# Altium project EEG.PrjPcb
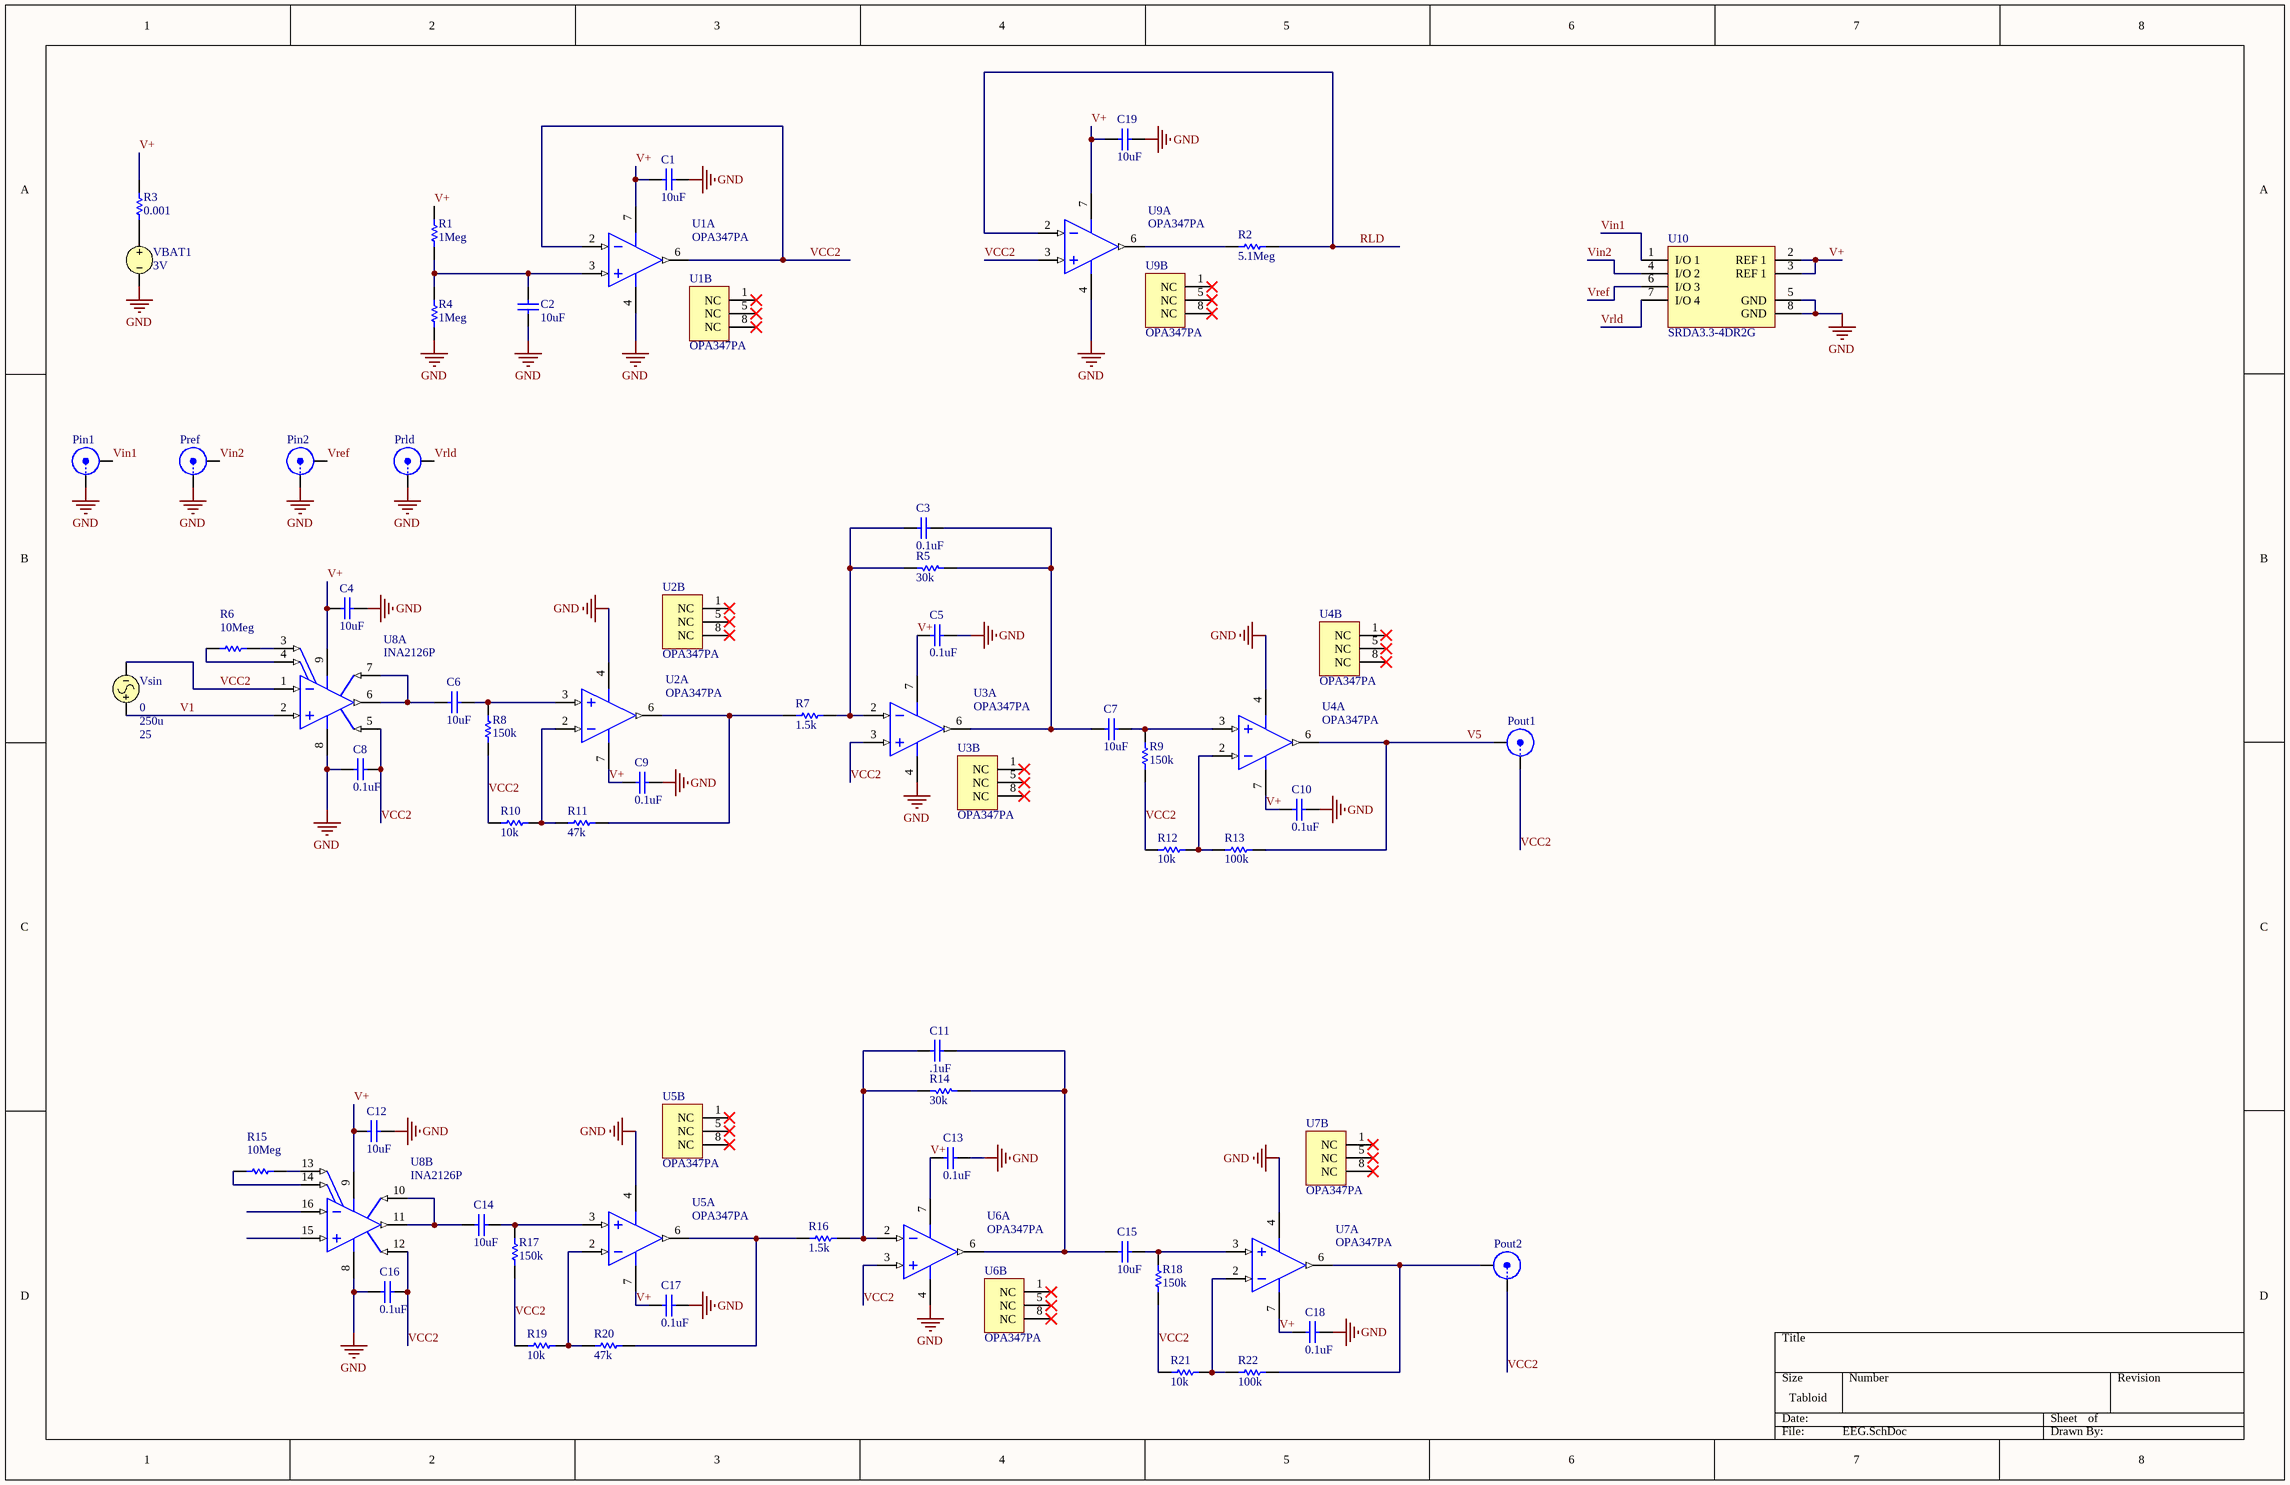
[diagram p0: EEG.SchDoc]
1 sheet, 59 parts. Net scope: global (net labels, ports and power ports of the same name join across sheets).

## Sheet EEG.SchDoc
size Tabloid; PageSetup: Record=PageOptions|CenterHorizontal=True|CenterVertical=True|PrintScale=1.00|XCorrection=1.00|YCorrection=1.00|PrintKind=1|BorderSize=5000000|LeftOffset=0|BottomOffset=0|Orientation=2|PaperLength=1000|PaperWidth=1000|Scale=100|PaperSource=7|PrintQuality=-3|MediaType=1|DitherType=10|PrintScaleMode=1|PaperKind=Statement|PaperIndex=6

### Parts
C1  10uF  [RAD-0.2]
C2  10uF  [RAD-0.2]
C3  0.1uF  [RAD-0.2]
C4  10uF  [RAD-0.2]
C5  0.1uF  [RAD-0.2]
C6  10uF  [RAD-0.2]
C7  10uF  [RAD-0.2]
C8  0.1uF  [RAD-0.2]
C9  0.1uF  [RAD-0.2]
C10  0.1uF  [RAD-0.2]
C11  .1uF  [RAD-0.2]
C12  10uF  [RAD-0.2]
C13  0.1uF  [RAD-0.2]
C14  10uF  [RAD-0.2]
C15  10uF  [RAD-0.2]
C16  0.1uF  [RAD-0.2]
C17  0.1uF  [RAD-0.2]
C18  0.1uF  [RAD-0.2]
C19  10uF  [RAD-0.2]
Pin1  BNC  [BNC_RA CON]  (value not drawn)
Pin2  BNC  [BNC_RA CON]  (value not drawn)
Pout1  BNC  [BNC_RA CON]  (value not drawn)
Pout2  BNC  [BNC_RA CON]  (value not drawn)
Pref  BNC  [BNC_RA CON]  (value not drawn)
Prld  BNC  [BNC_RA CON]  (value not drawn)
R1  1Meg  [AXIAL-0.3]
R2  5.1Meg  [AXIAL-0.3]
R3  0.001  [AXIAL-0.3]
R4  1Meg  [AXIAL-0.3]
R5  30k  [AXIAL-0.3]
R6  10Meg  [AXIAL-0.3]
R7  1.5k  [AXIAL-0.3]
R8  150k  [AXIAL-0.3]
R9  150k  [AXIAL-0.3]
R10  10k  [AXIAL-0.3]
R11  47k  [AXIAL-0.3]
R12  10k  [AXIAL-0.3]
R13  100k  [AXIAL-0.3]
R14  30k  [AXIAL-0.3]
R15  10Meg  [AXIAL-0.3]
R16  1.5k  [AXIAL-0.3]
R17  150k  [AXIAL-0.3]
R18  150k  [AXIAL-0.3]
R19  10k  [AXIAL-0.3]
R20  47k  [AXIAL-0.3]
R21  10k  [AXIAL-0.3]
R22  100k  [AXIAL-0.3]
U1  OPA347PA  [TI-P8]  (parts A,B of 2)
U2  OPA347PA  [TI-P8]  (parts A,B of 2)
U3  OPA347PA  [TI-P8]  (parts A,B of 2)
U4  OPA347PA  [TI-P8]  (parts A,B of 2)
U5  OPA347PA  [TI-P8]  (parts A,B of 2)
U6  OPA347PA  [TI-P8]  (parts A,B of 2)
U7  OPA347PA  [TI-P8]  (parts A,B of 2)
U8  INA2126P  [TI-N16]  (parts A,B of 2)
U9  OPA347PA  [TI-P8]  (parts A,B of 2)
U10  SRDA3.3-4DR2G  [ONSC-SOIC-8-751-07_V]
VBAT1  3V
Vsin  DC Magnitude: 0  Amplitude: 250u  Frequency: 25  (hidden comment: VSIN)

### Nets
GND: C1.1 C2.1 C4.1 C5.1 C8.2 C9.1 C10.1 C12.1 C13.1 C16.2 C17.1 C18.1 C19.1 Pin1.1(X) Pin2.1(X) Pref.1(X) Prld.1(X) R4.1 U1.4(V-) U2.4(V-) U3.4(V-) U4.4(V-) U5.4(V-) U6.4(V-) U7.4(V-) U8.8(V-) U9.4(V-) U10.5(GND) U10.8(GND) VBAT1.2
RLD: R2.1 U9.2(IN-)
V1: U8.2(VINA+) Vsin.1
V5: Pout1.2(Y) R13.2 U4.6(OUT)
V+: C1.2 C4.2 C5.2 C9.2 C10.2 C12.2 C13.2 C17.2 C18.2 C19.2 R1.2 R3.2 U1.7(V+) U2.7(V+) U3.7(V+) U4.7(V+) U5.7(V+) U6.7(V+) U7.7(V+) U8.9(V+) U9.7(V+) U10.2(REF_1) U10.3(REF_1)
VCC2: C8.1 C16.1 Pout1.1(X) Pout2.1(X) R8.2 R9.2 R10.1 R12.1 R17.2 R18.2 R19.1 R21.1 U1.2(IN-) U1.6(OUT) U3.3(IN+) U6.3(IN+) U8.1(VINA-) U8.5(REFA) U8.12(REFB) U9.3(IN+) Vsin.2
Vin1: Pin1.2(Y) U10.1(I/O_1)
Vin2: Pref.2(Y) U10.4(I/O_2)
Vref: Pin2.2(Y) U10.6(I/O_3)
Vrld: Prld.2(Y) U10.7(I/O_4)
NetC2_2: C2.2 R1.1 R4.2 U1.3(IN+)
NetC3_1: C3.1 C7.2 R5.2 U3.6(OUT)
NetC3_2: C3.2 R5.1 R7.2 U3.2(IN-)
NetC6_1: C6.1 R8.1 U2.3(IN+)
NetC6_2: C6.2 U8.6(VOA) U8.7(SENSEA)
NetC7_1: C7.1 R9.1 U4.3(IN+)
NetC11_1: C11.1 C15.2 R14.2 U6.6(OUT)
NetC11_2: C11.2 R14.1 R16.2 U6.2(IN-)
NetC14_1: C14.1 R17.1 U5.3(IN+)
NetC14_2: C14.2 U8.10(SENSEB) U8.11(VOB)
NetC15_1: C15.1 R18.1 U7.3(IN+)
NetPout2_2: Pout2.2(Y) R22.2 U7.6(OUT)
NetR2_2: R2.2 U9.6(OUT)
NetR3_1: R3.1 VBAT1.1
NetR6_1: R6.1 U8.3(RGA)
NetR6_2: R6.2 U8.4(RGA)
NetR7_1: R7.1 R11.2 U2.6(OUT)
NetR10_2: R10.2 R11.1 U2.2(IN-)
NetR12_2: R12.2 R13.1 U4.2(IN-)
NetR15_1: R15.1 U8.13(RGB)
NetR15_2: R15.2 U8.14(RGB)
NetR16_1: R16.1 R20.2 U5.6(OUT)
NetR19_2: R19.2 R20.1 U5.2(IN-)
NetR21_2: R21.2 R22.1 U7.2(IN-)

Not connected (* = marked no-connect by the designer): U1 1(NC)* 5(NC)* 8(NC)*; U2 1(NC)* 5(NC)* 8(NC)*; U3 1(NC)* 5(NC)* 8(NC)*; U4 1(NC)* 5(NC)* 8(NC)*; U5 1(NC)* 5(NC)* 8(NC)*; U6 1(NC)* 5(NC)* 8(NC)*; U7 1(NC)* 5(NC)* 8(NC)*; U8 15(VINB+) 16(VINB-); U9 1(NC)* 5(NC)* 8(NC)*

### Library data of the parts
C1-C19 = Cap: Capacitor; Published: 8-Jun-2000; LatestRevisionDate: 17-Jul-2002; LatestRevisionNote: Re-released for DXP Platform.; PackageReference: RAD-0.3; Publisher: Altium Limited; PackageDescription: Radial Cap, Thru-Hole; 2 Leads; 0.3 in Pin Spacing
  C1 C2 C4 C6 C7 C12 C14 C15 C19: Value: 10uF
  C3 C5 C8-C10 C13 C16-C18: Value: 0.1uF
  C11: Value: .1uF
Pin1 Pin2 Pout1 Pout2 Pref Prld = BNC: BNC Elbow Connector; LatestRevisionDate: 17-Jul-2002; LatestRevisionNote: Re-released for DXP Platform.; Publisher: Altium Limited
R1-R22 = Res1: Resistor; Published: 8-Jun-2000; LatestRevisionDate: 17-Jul-2002; LatestRevisionNote: Re-released for DXP Platform.; PackageReference: AXIAL-0.3; Publisher: Altium Limited; PackageDescription: Axial Device, Thru-Hole; 2 Leads; 0.3 in Pin Spacing
  R1 R4: Value: 1Meg
  R2: Value: 5.1Meg
  R3: Value: 0.001
  R5 R14: Value: 30k
  R6 R15: Value: 10Meg
  R7 R16: Value: 1.5k
  R8 R9 R17 R18: Value: 150k
  R10 R12 R19 R21: Value: 10k
  R11 R20: Value: 47k
  R13 R22: Value: 100k
U1-U7 U9 = OPA347PA: MicroPower, Rail-to-Rail Operational Amplifier, 2.3 to 5.5 V, -55 to 125 degC, 8-pin DIP (P8), Green (RoHS & no Sb/Br); Manufacturer: Texas Instruments; CMRR(Min)(dB): 70; GBW(Typ)(MHz): 0.35; IIB(Max)(pA): 10; Iq per channel(Max)(mA): 0.034; Number of Channels: 1; Offset Drift(Typ)(uV/C): 3; Packing: TUBE; Rating: Catalog; Slew Rate(Typ)(V/us): 0.17; Sub Family: Low Input Bias Current Amp (<=10pA), Low Power Amp (<=500uA), Low Supply Voltage Amplifier (<=2.7V), Precision Amplifier; Total Supply Voltage(Max)(+5V is 5, +/-5V is 10): 5.5; Total Supply Voltage(Min)(+5V is 5, +/-5V is 10): 2.3; Vio (25C)(Max)(mV): 6; DatasheetVersion: SBOS167D; PackageVersion: 4040082/E, 04/2010; PackageReference: P8; PackageDescription: 8-Pin Plastic In-Line, Body 9.59 x 6.35 mm, Pitch 2.54 mm; Supplier 1: Digi-Key; Supplier Part Number 1: OPA347PA-ND; Supplier 2: Newark; Supplier Part Number 2: 75C4881; Supplier 3: Mouser; Supplier Part Number 3: 595-OPA347PA; Eco-Plan: Green (RoHS & no Sb/Br); Mounting Technology: Through Hole; Code_JEDEC: MS-001; PartNumber: OPA347PA; ComponentLink1Description: Manufacturer URL; ComponentLink1URL: http://www.ti.com/; ComponentLink2Description: Datasheet; ComponentLink2URL: http://www.ti.com/lit/ds/symlink/opa347.pdf; ComponentLink3Description: Package Specification; ComponentLink3URL: http://www.ti.com/litv/pdf/mpdi001b
U8 = INA2126P: Micropower Instrumentation Amplifier Dual Versions, -40 to 85 degC, 16-pin DIP (N16), Green (RoHS & no Sb/Br); Manufacturer: Texas Instruments; Bandwidth at G: 100(Min)(kHz)=9; CMRR(Min)(dB): 83; Gain(V/V): 5 to 10000; Input Bias Current (+/-)(Max)(nA): 25; Input Offset (+/-)(Max)(uV): 250; Input Offset Drift (+/-)(Max)(uV/Degrees Celsius): 3; Noise at 1kHz(Typ)(nV/rt(Hz)): 35; Non-Linearity (+/-)(Max)(%): 0.012; Number of Channels: 2; Quiescent Current (+/-)(Typ)(mA): 0.175; SubFamily: Dual Supply; Vs(Max)(V): 36; Vs(Min)(V): 2.7; DatasheetVersion: SBOS062A; PackageVersion: 4040049/E, 12/2002; PackageReference: N16; PackageDescription: 16-Pin Plastic In-Line, Body 19.305 x 6.35 mm, Pitch 2.54 mm; Supplier 1: Digi-Key; Supplier Part Number 1: INA2126P-ND; Supplier 2: Farnell; Supplier Part Number 2: 1535404; Supplier 3: Newark; Supplier Part Number 3: 74C9838; Supplier 4: Mouser; Supplier Part Number 4: 595-INA2126P; Eco-Plan: Green (RoHS & no Sb/Br); Mounting Technology: Through Hole; Code_JEDEC: MS-001; PartNumber: INA2126P; ComponentLink1Description: Manufacturer URL; ComponentLink1URL: http://www.ti.com/; ComponentLink2Description: Datasheet; ComponentLink2URL: http://www.ti.com/general/docs/lit/getliterature.tsp?genericPartNumber=INA2126&fileType=pdf; ComponentLink3Description: Package Specification; ComponentLink3URL: http://www.ti.com/litv/pdf/mpdi002c
U10 = CMP-1063-00128-1: Low Capacitance Surface Mount TVS for High-Speed Data Interface, 8-Pin SOIC, Pb-Free, Tape and Reel; Manufacturer: On Semiconductor; V(BR) Min (V): 5; PPK Max (W): 500; Number of Lines: 4; VRWM Max (V): 3.3; Direction: Unidirectional; ComponentLink3Description: Package Specification; ComponentLink1Description: Manufacturer URL; ComponentLink1URL: http://www.onsemi.com/; RoHS: Pb-Free; Mounting Technology: Surface Mount; ComponentLink3URL: http://www.onsemi.com/pub_link/Collateral/751-07.PDF; PackageVersion: Rev. AK, 02/2011; ComponentLink2Description: Datasheet; PackageReference: SOIC-8-751-07; PartNumber: SRDA3.3-4DR2G; PackageDescription: 8-Pin Small Outline Integrated Circuit, Body 4.9 x 3.9 mm, Pitch 1.27 mm; Packing: Tape and Reel; ComponentLink2URL: http://www.onsemi.cn/pub_link/Collateral/SRDA3.3-4-D.PDF; DatasheetVersion: Rev. 0; IR Max (uA): 5
VBAT1 = VSRC: Voltage Source; Note: PCB Footprint - Not required; Published: 8-Jun-2000; LatestRevisionDate: 17-Jul-2002; LatestRevisionNote: Re-released for DXP Platform.; PackageReference: Not Applicable; Publisher: Altium Limited; Value: 3V
Vsin = VSIN: Sinusoidal Voltage Source; Note: PCB Footprint - Not required; Published: 8-Jun-2000; LatestRevisionDate: 15-Nov-2004; LatestRevisionNote: Corrected Netlist.; PackageReference: Not Applicable; Publisher: Altium Limited